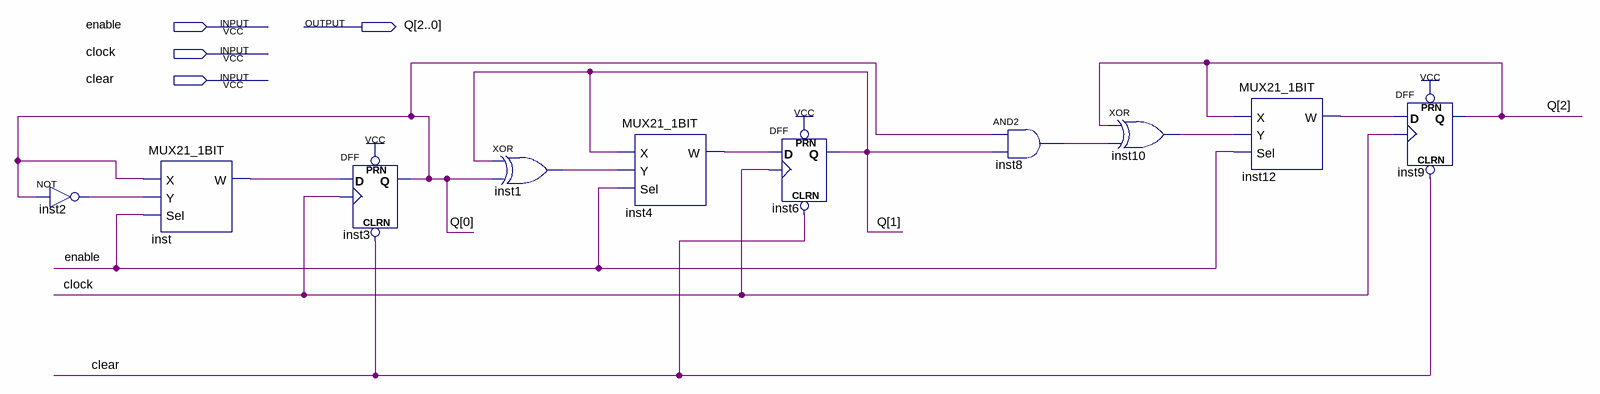
[diagram p0: schematic sheet]
// Quartus schematic Somador.bdf as structural Verilog: 10 symbols, 4 pins
module Somador (
  input  enable,
  input  clock,
  input  clear,
  output [2:0] Q
);

  wire inst1_out, inst2_out, inst4_w, inst8_out, inst10_out, inst12_w, inst_w;

  not inst2 (inst2_out, Q[0]);
  MUX21_1BIT inst (.X(Q[0]), .Y(inst2_out), .Sel(enable), .W(inst_w));
  DFF inst3 (.CLRN(clear), .CLK(clock), .D(inst_w), .PRN(1'b1), .Q(Q[0]));
  xor inst1 (inst1_out, Q[1], Q[0]);
  MUX21_1BIT inst4 (.X(Q[1]), .Y(inst1_out), .Sel(enable), .W(inst4_w));
  DFF inst6 (.CLRN(clear), .CLK(clock), .D(inst4_w), .PRN(1'b1), .Q(Q[1]));
  and inst8 (inst8_out, Q[0], Q[1]);
  xor inst10 (inst10_out, Q[2], inst8_out);
  MUX21_1BIT inst12 (.X(Q[2]), .Y(inst10_out), .Sel(enable), .W(inst12_w));
  DFF inst9 (.CLRN(clear), .CLK(clock), .D(inst12_w), .PRN(1'b1), .Q(Q[2]));
endmodule
